# EAGLE schematic byt (EAGLE 9.0.1)
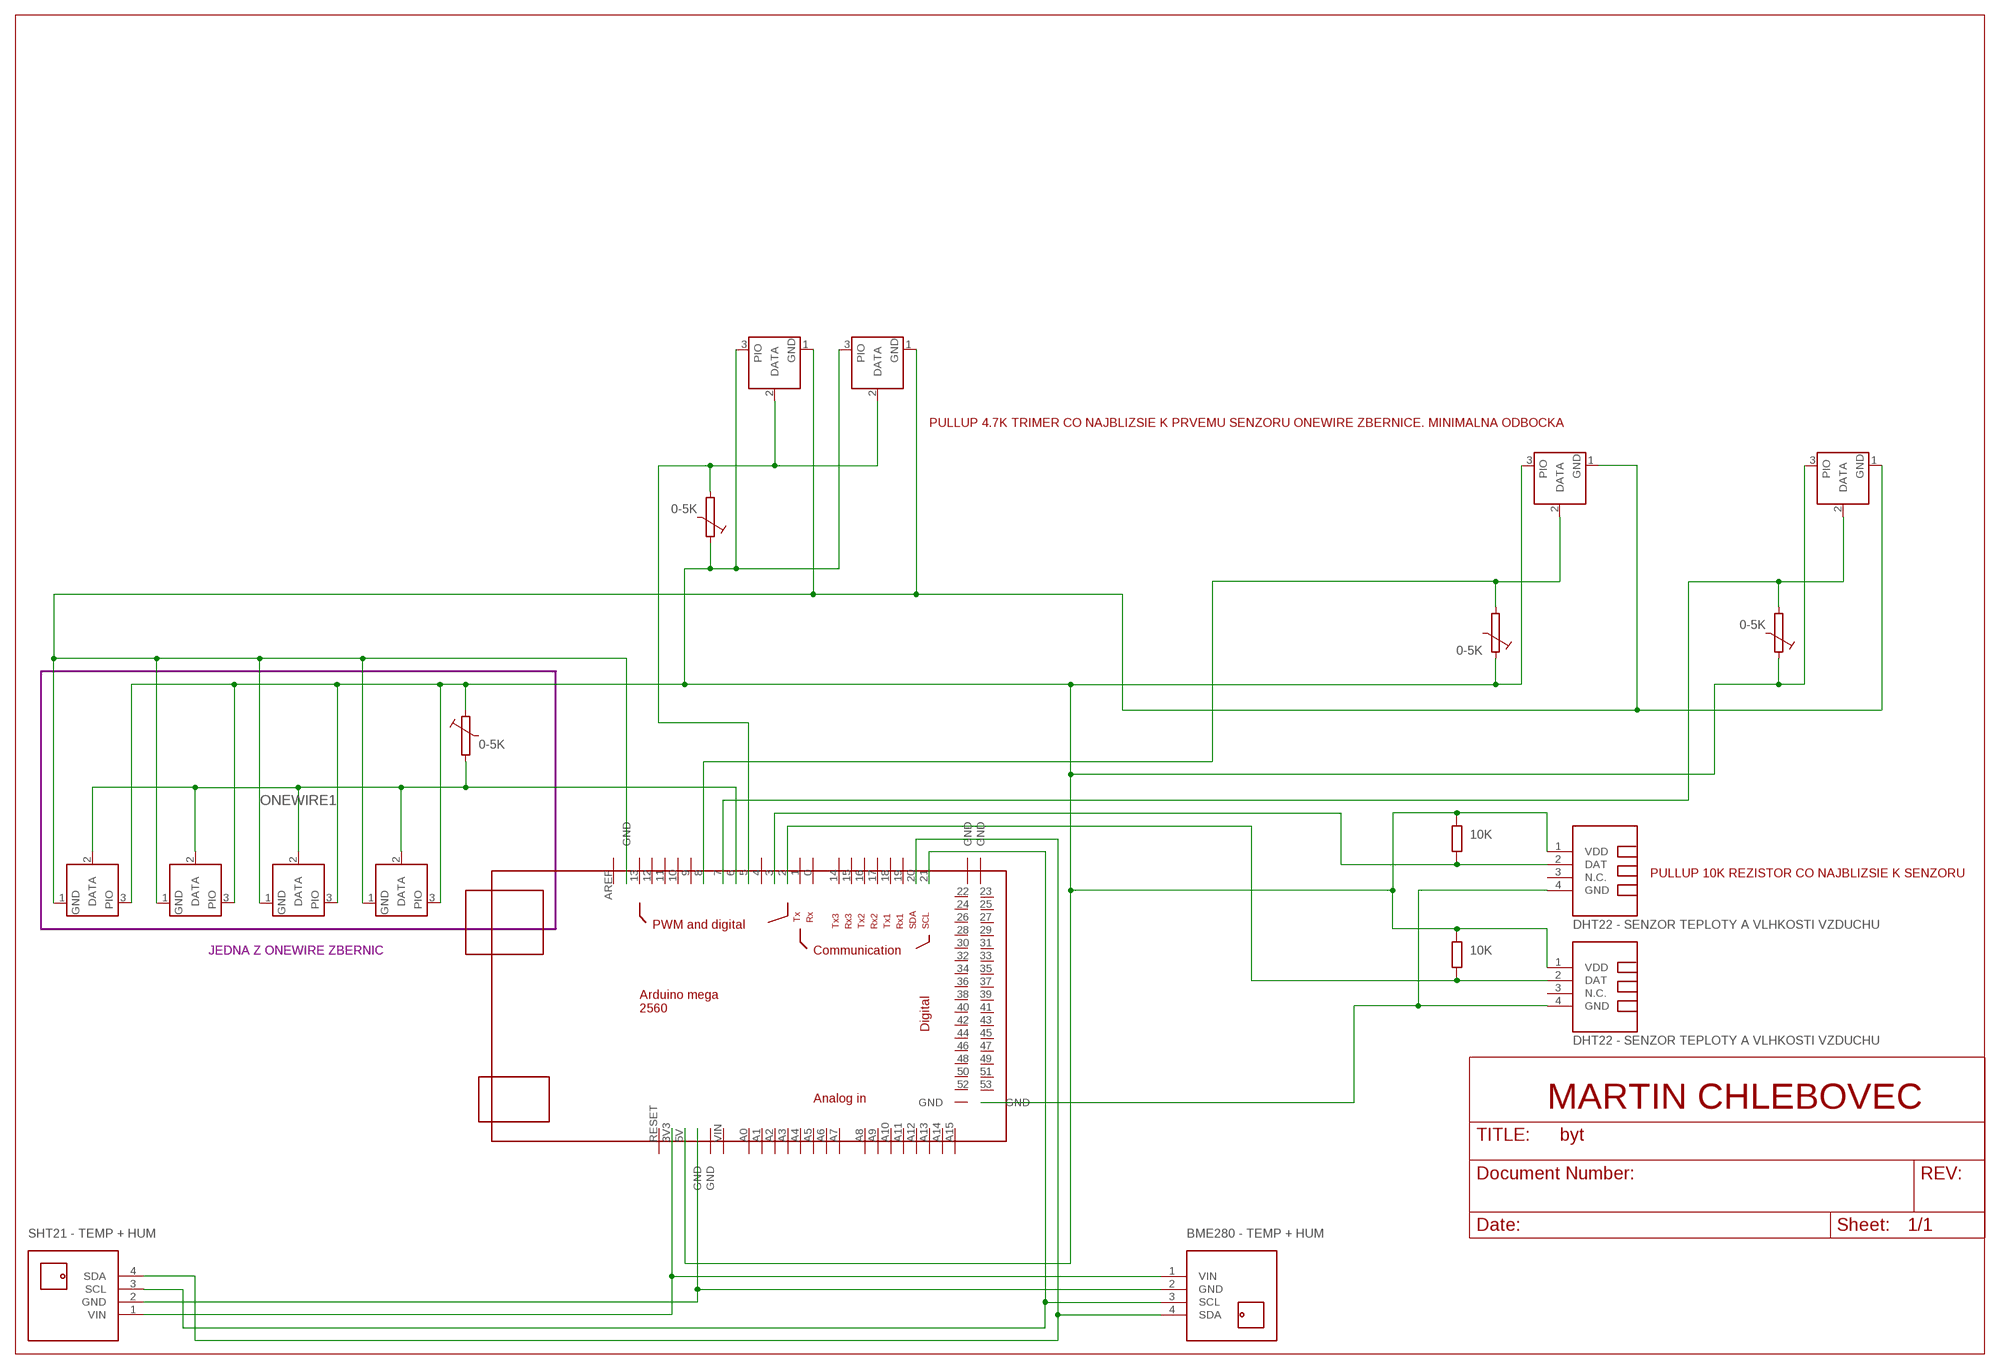
[diagram p0: schematic, sheet 1]

## Parts
IC2  DS2405  [TO92-]
IC3  DS2405  [TO92-]
IC6  DS2405  [TO92-]
IC7  DS2405  [TO92-]
IC8  DS2405  [TO92-]
IC10  DS2405  [TO92-]
IC11  DS2405  [TO92-]
IC12  DS2405  [TO92-]
U$1  MEGA_DEVICE  [MEGAOUTLINE]
U$2  TEMP-HUM-SENSOR-DHT22  [TEMP-HUM-SENSOR-DHT22]
U$3  TEMP-HUM-SENSOR-DHT22  [TEMP-HUM-SENSOR-DHT22]
U$4  TEMP-HUM-PRES-BME280  [TEMP-HUM-PRES-BME280]
U$5  TEMP-HUM-SENSOR-HTU21D  [TEMP-HUM-SENSOR-HTU21D]

## Module instances
ONEWIRE1 = ONEWIRE

## Nets
N$1: IC2.2(DATA) IC3.2(DATA) IC6.2(DATA) IC7.2(DATA) U$1.6
N$2: U$1.2 U$3.2(DAT)
N$3: U$1.3V3 U$4.1(VIN) U$5.1(VIN)
N$4: IC10.2(DATA) U$1.8
N$5: U$1.GND@2(GND) U$4.2(GND) U$5.2(GND)
N$6: U$1.21 U$4.3(SCL) U$5.3(SCL)
N$7: U$1.20 U$4.4(SDA) U$5.4(SDA)
N$8: U$1.GND@7(GND) U$2.4(GND) U$3.4(GND)
N$9: U$1.3 U$2.2(DAT)
N$10: IC2.3(PIO) IC3.3(PIO) IC6.3(PIO) IC7.3(PIO) IC8.3(PIO) IC10.3(PIO) IC11.3(PIO) IC12.3(PIO) U$1.5V U$2.1(VDD) U$3.1(VDD)
N$11: IC8.2(DATA) U$1.7
N$14: IC11.2(DATA) IC12.2(DATA) U$1.5
N$25: IC2.1(GND) IC3.1(GND) IC6.1(GND) IC7.1(GND) IC8.1(GND) IC10.1(GND) IC11.1(GND) IC12.1(GND) U$1.GND@1(GND)
Unconnected: U$1.0 U$1.1 U$1.4 U$1.9 U$1.10 U$1.11 U$1.12 U$1.13 U$1.14 U$1.15 U$1.16 U$1.17 U$1.18 U$1.19 U$1.22 U$1.23 U$1.24 U$1.25 U$1.26 U$1.27 U$1.28 U$1.29 U$1.30 U$1.31 U$1.32 U$1.33 U$1.34 U$1.35 U$1.36 U$1.37 U$1.38 U$1.39 U$1.40 U$1.41 U$1.42 U$1.43 U$1.44 U$1.45 U$1.46 U$1.47 U$1.48 U$1.49 U$1.50 U$1.51 U$1.52 U$1.53 U$1.A0 U$1.A1 U$1.A2 U$1.A3 U$1.A4 U$1.A5 U$1.A6 U$1.A7 U$1.A8 U$1.A9 U$1.A10 U$1.A11 U$1.A12 U$1.A13 U$1.A14 U$1.A15 U$1.AREF U$1.GND@3(GND) U$1.GND@4(GND) U$1.GND@5(GND) U$1.GND@6(GND) U$1.RESET U$1.VIN U$2.3(N.C.) U$3.3(N.C.)

## Notes on the sheet
- PULLUP 4.7K TRIMER CO NAJBLIZSIE K PRVEMU SENZORU ONEWIRE ZBERNICE. MINIMALNA ODBOCKA
- 0-5K
- 0-5K
- 0-5K
- 0-5K
- 10K
- PULLUP 10K REZISTOR CO NAJBLIZSIE K SENZORU
- DHT22 - SENZOR TEPLOTY A VLHKOSTI VZDUCHU
- JEDNA Z ONEWIRE ZBERNIC | 10K
- DHT22 - SENZOR TEPLOTY A VLHKOSTI VZDUCHU
- MARTIN CHLEBOVEC
- SHT21 - TEMP + HUM | BME280 - TEMP + HUM

## Library data of the parts
IC2 IC3 IC6-IC8 IC10-IC12 = maxim:DS2405: Addressable Switch DALLAS Semiconductor; MF: DALLAS SEMICONDUCTOR; MPN: DS2405; OC_FARNELL: 1188025; OC_NEWARK: 06F4645
U$1 = ArduinoMegaOutline:MEGA_DEVICE: mega card as device
U$2 U$3 = diy-modules (2):TEMP-HUM-SENSOR-DHT22: DHT22 - digital humidity & temperature sensor Also known as: AM2302 AM2302 datasheet available here: http://akizukidenshi.com/download/ds/aosong/AM2302.pdf Click here to find device on ebay.com <http://www.ebay.com/sch/dht22+digital+sensor>
U$4 = diy-modules:TEMP-HUM-PRES-BME280: Digital Humidity-Temperature-Pressure Sensor based on BME280 device More information about BME280 device is available here: https://www.bosch-sensortec.com/bst/products/all_products/bme280 Click here to find device on ebay.com <http://www.ebay.com/sch/bme280+breakout>
U$5 = diy-modules:TEMP-HUM-SENSOR-HTU21D: Digital Humidity & Temperature Sensor based on HTU21D device More information about HTU21D device is available here: http://futureeverything.org/wp-content/uploads/2014/05/Humidity-Datasheet.pdf HTU21D Arudino Library is available here: https://learn.sparkfun.com/tutorials/htu21d-humidity-sensor-hookup-guide/htu21d-library-and-functions Click here to find device on ebay.com <http://www.ebay.com/sch/htu21d+board>

## Module ONEWIRE
Ports: 

### Library data of the parts